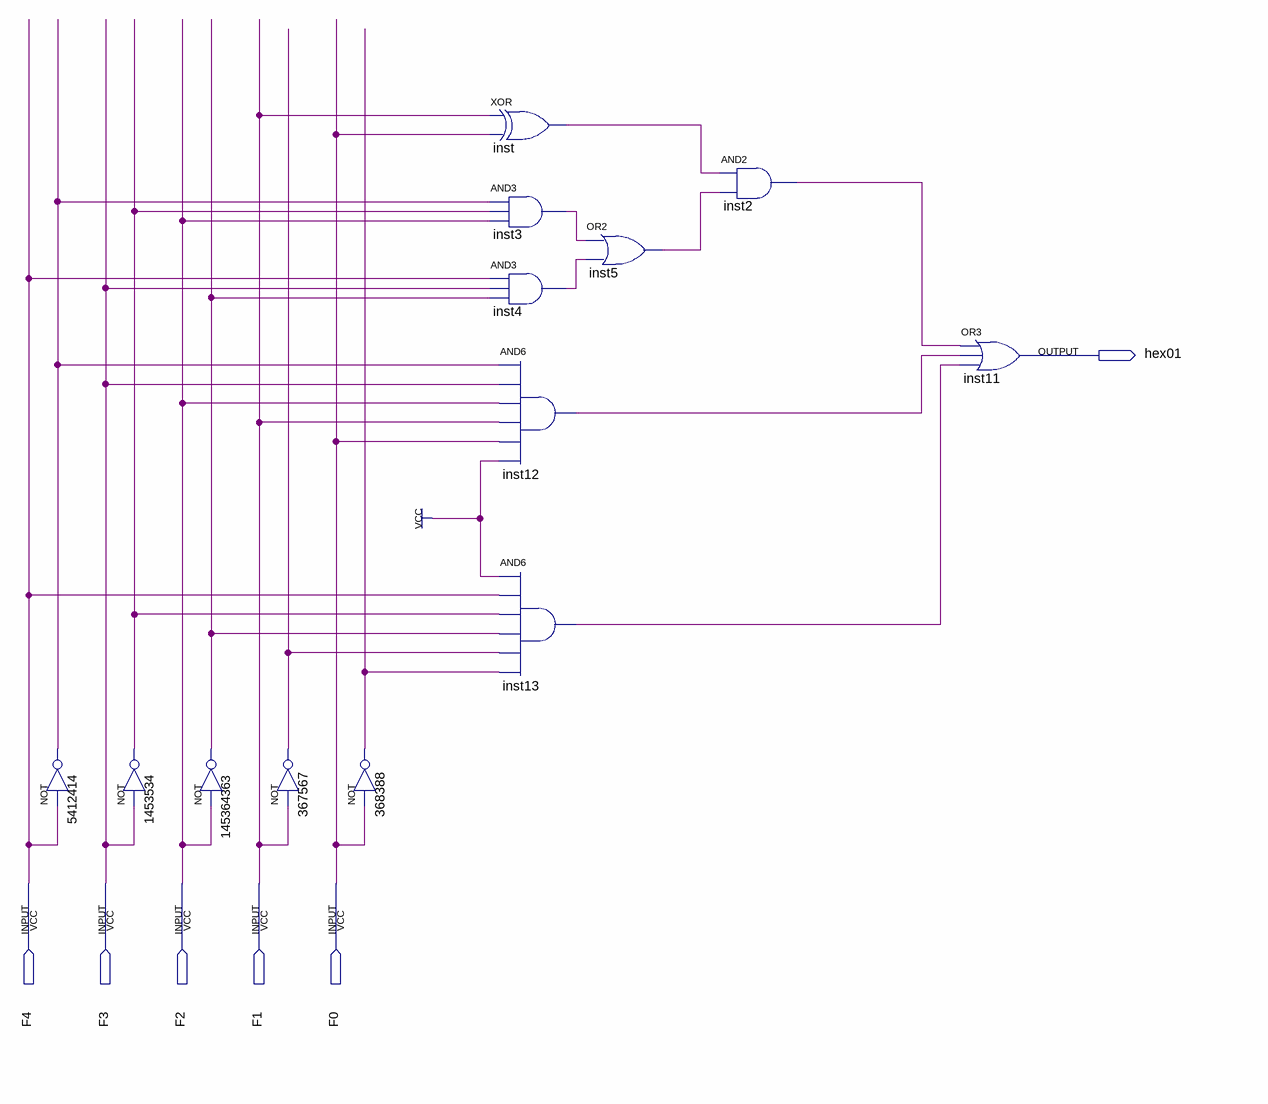
[diagram p0: schematic sheet]
// Quartus schematic U01.bdf as structural Verilog: 13 symbols, 6 pins
module U01 (
  input  F4,
  input  F3,
  input  F2,
  input  F1,
  input  F0,
  output hex01
);

  wire inst2_out, inst3_out, inst4_out, inst5_out, inst12_out, inst13_out, inst_out, n367567_out,
       n368388_out, n1453534_out, n5412414_out, n145364363_out;

  not u_5412414 (n5412414_out, F4);
  not u_1453534 (n1453534_out, F3);
  not u_145364363 (n145364363_out, F2);
  not u_367567 (n367567_out, F1);
  not u_368388 (n368388_out, F0);
  xor inst (inst_out, F1, F0);
  and inst3 (inst3_out, n5412414_out, n1453534_out, F2);
  and inst4 (inst4_out, F4, F3, n145364363_out);
  and inst12 (inst12_out, n5412414_out, F3, F2, F1, F0, 1'b1);
  and inst13 (inst13_out, 1'b1, F4, n1453534_out, n145364363_out, n367567_out, n368388_out);
  or inst5 (inst5_out, inst3_out, inst4_out);
  and inst2 (inst2_out, inst_out, inst5_out);
  or inst11 (hex01, inst2_out, inst12_out, inst13_out);
endmodule
